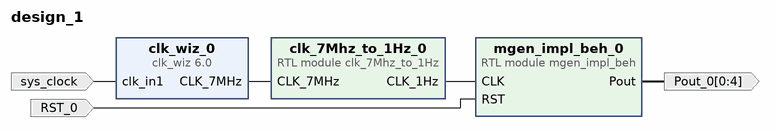
[diagram p0: block diagram of the top level]
# Vivado block design design_1, xc7a100tcsg324-1, Vivado 2018.2
create_bd_design design_1

create_bd_port -dir I -type clk sys_clock
set_property -dict {CONFIG.FREQ_HZ 100000000 CONFIG.PHASE 0.000} [get_bd_ports sys_clock]
create_bd_port -dir O -from 0 -to 4 Pout_0
create_bd_port -dir I -type rst RST_0

create_bd_cell -type ip -vlnv xilinx.com:ip:clk_wiz:6.0 clk_wiz_0
set_property -dict [list \
  CONFIG.PRIMITIVE MMCM \
  CONFIG.CLK_OUT1_PORT CLK_7MHz \
  CONFIG.CLKOUT1_REQUESTED_OUT_FREQ 7.000 \
  CONFIG.CLKOUT1_DRIVES BUFG \
  CONFIG.CLKOUT2_DRIVES BUFG \
  CONFIG.CLKOUT3_DRIVES BUFG \
  CONFIG.CLKOUT4_DRIVES BUFG \
  CONFIG.CLKOUT5_DRIVES BUFG \
  CONFIG.CLKOUT6_DRIVES BUFG \
  CONFIG.CLKOUT7_DRIVES BUFG \
  CONFIG.FEEDBACK_SOURCE FDBK_AUTO \
  CONFIG.OVERRIDE_MMCM false \
  CONFIG.MMCM_DIVCLK_DIVIDE 5 \
  CONFIG.MMCM_CLKFBOUT_MULT_F 44.625 \
  CONFIG.MMCM_COMPENSATION ZHOLD \
  CONFIG.MMCM_CLKOUT0_DIVIDE_F 127.500 \
  CONFIG.USE_BOARD_FLOW true \
  CONFIG.CLK_IN1_BOARD_INTERFACE sys_clock \
  CONFIG.CLK_IN2_BOARD_INTERFACE Custom \
  CONFIG.RESET_BOARD_INTERFACE reset \
  CONFIG.CLKOUT1_JITTER 429.404 \
  CONFIG.CLKOUT1_PHASE_ERROR 301.475 \
] [get_bd_cells clk_wiz_0]
create_bd_cell -type module -reference mgen_impl_beh mgen_impl_beh_0
create_bd_cell -type module -reference clk_7Mhz_to_1Hz clk_7Mhz_to_1Hz_0

# ---- connections ----

connect_bd_net [get_bd_ports sys_clock] [get_bd_pins clk_wiz_0/clk_in1]
connect_bd_net [get_bd_pins mgen_impl_beh_0/Pout] [get_bd_ports Pout_0]
connect_bd_net -net RST_0_1 [get_bd_ports RST_0] [get_bd_pins mgen_impl_beh_0/RST]
connect_bd_net [get_bd_pins clk_wiz_0/CLK_7MHz] [get_bd_pins clk_7Mhz_to_1Hz_0/CLK_7MHz]
connect_bd_net [get_bd_pins clk_7Mhz_to_1Hz_0/CLK_1Hz] [get_bd_pins mgen_impl_beh_0/CLK]

validate_bd_design
save_bd_design
